# Altium schematic sheet tie-il-cfg.SchDoc: Copper Suicide - Net Tie CFG
size Letter; CheckedBy: E. Chiu; CompanyName: Signal Laboratories, Inc.; DrawnBy: J. Brinton; Engineer: J. Brinton; Address1: 3479 Edison Way; Address2: Menlo Park CA 94025; Address3: +1 (877) 778-8435; Address4: siglabs.com; Revision: 1; SheetNumber: 20; SheetTotal: 44
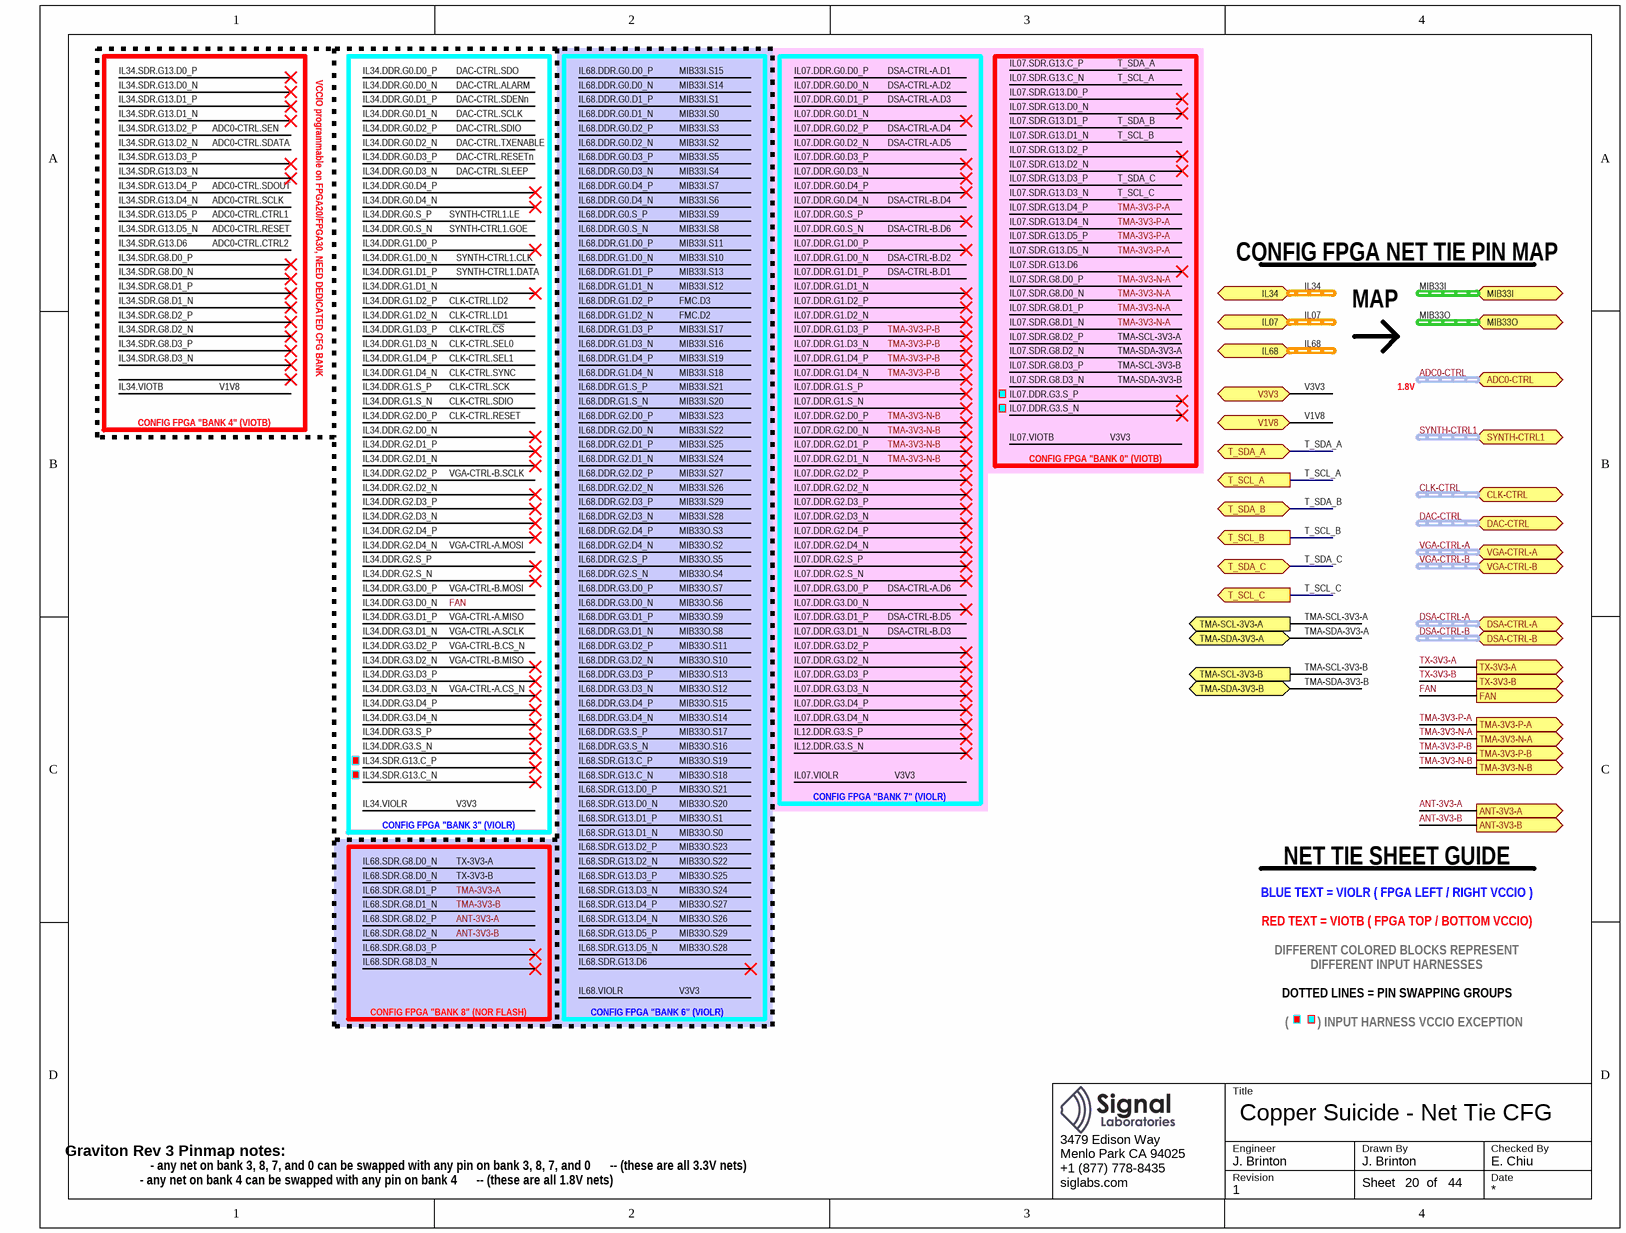
[diagram p0: tie-il-cfg.SchDoc]

## Ports
ADC0-CTRL (harness ADC-CTRL-1V8), ANT-3V3-A (out), ANT-3V3-B (out), CLK-CTRL (harness CLK-CTRL), DAC-CTRL (harness DAC-CTRL), DSA-CTRL-A (harness DSA_CTRL), DSA-CTRL-B (harness DSA_CTRL), FAN (out), IL07 (harness IL), IL34 (harness IL), IL68 (harness IL), MIB33I (harness MIB), MIB33O (harness MIB), SYNTH-CTRL1 (harness SYNTH-CTRL), T_SCL_A (out), T_SCL_B (out), T_SCL_C (out), T_SDA_A (bidir), T_SDA_B (bidir), T_SDA_C (bidir), TMA-3V3-N-A (out), TMA-3V3-N-B (out), TMA-3V3-P-A (out), TMA-3V3-P-B (out), TMA-SCL-3V3-A (out), TMA-SCL-3V3-B (out), TMA-SDA-3V3-A (bidir), TMA-SDA-3V3-B (bidir), TX-3V3-A (out), TX-3V3-B (out), V1V8, V3V3, VGA-CTRL-A (harness SPI), VGA-CTRL-B (harness SPI)

## Nets
ANT-3V3-A: port ANT-3V3-A  [also labelled IL68.SDR.G8.D2_P]
ANT-3V3-B: port ANT-3V3-B  [also labelled IL68.SDR.G8.D2_N]
FAN: port FAN  [also labelled IL34.DDR.G3.D0_N]
IL07.DDR.G1.D3_N: port TMA-3V3-P-B  [also labelled IL07.DDR.G1.D3_P, IL07.DDR.G1.D4_N, IL07.DDR.G1.D4_P, TMA-3V3-P-B]
IL07.DDR.G2.D0_N: port TMA-3V3-N-B  [also labelled IL07.DDR.G2.D0_P, IL07.DDR.G2.D1_N, IL07.DDR.G2.D1_P, TMA-3V3-N-B]
IL07.SDR.G8.D0_N: port TMA-3V3-N-A  [also labelled IL07.SDR.G8.D0_P, IL07.SDR.G8.D1_N, IL07.SDR.G8.D1_P, TMA-3V3-N-A]
IL07.SDR.G8.D2_N: port TMA-SDA-3V3-A  [also labelled TMA-SDA-3V3-A]
IL07.SDR.G8.D2_P: port TMA-SCL-3V3-A  [also labelled TMA-SCL-3V3-A]
IL07.SDR.G8.D3_N: port TMA-SDA-3V3-B  [also labelled TMA-SDA-3V3-B]
IL07.SDR.G8.D3_P: port TMA-SCL-3V3-B  [also labelled TMA-SCL-3V3-B]
IL07.SDR.G13.C_N: port T_SCL_A  [also labelled T_SCL_A]
IL07.SDR.G13.C_P: port T_SDA_A  [also labelled T_SDA_A]
IL07.SDR.G13.D1_N: port T_SCL_B  [also labelled T_SCL_B]
IL07.SDR.G13.D1_P: port T_SDA_B  [also labelled T_SDA_B]
IL07.SDR.G13.D3_N: port T_SCL_C  [also labelled T_SCL_C]
IL07.SDR.G13.D3_P: port T_SDA_C  [also labelled T_SDA_C]
IL07.SDR.G13.D4_N: port TMA-3V3-P-A  [also labelled IL07.SDR.G13.D4_P, IL07.SDR.G13.D5_N, IL07.SDR.G13.D5_P, TMA-3V3-P-A]
IL07.VIOLR: port V3V3  [also labelled IL07.VIOTB, IL34.VIOLR, IL68.VIOLR, V3V3]
IL34.VIOTB: port V1V8  [also labelled V1V8]
IL68.SDR.G8.D0_N: port TX-3V3-B, port TX-3V3-A  [also labelled TX-3V3-A, TX-3V3-B]

## Buses and harness runs
harness ADC0-CTRL = port ADC0-CTRL
harness CLK-CTRL = port CLK-CTRL
harness DAC-CTRL = port DAC-CTRL
harness DSA-CTRL-A = port DSA-CTRL-A
harness DSA-CTRL-B = port DSA-CTRL-B
harness IL07 = port IL07
harness IL34 = port IL34
harness IL68 = port IL68
harness MIB33I = port MIB33I
harness MIB33O = port MIB33O
harness SYNTH-CTRL1 = port SYNTH-CTRL1
harness VGA-CTRL-A = port VGA-CTRL-A
harness VGA-CTRL-B = port VGA-CTRL-B

## Notes on the sheet
- VCCIO programmable on FPGA20/FPGA30, NEED DEDICATED CFG BANK
- CONFIG FPGA NET TIE PIN MAP
- MAP
- 1.8V
- CONFIG FPGA "BANK 4" (VIOTB)
- CONFIG FPGA "BANK 0" (VIOTB)
- CONFIG FPGA "BANK 3" (VIOLR)
- CONFIG FPGA "BANK 7" (VIOLR)
- BLUE TEXT = VIOLR ( FPGA LEFT / RIGHT VCCIO )
- NET TIE SHEET GUIDE
- DIFFERENT INPUT HARNESSES
- DIFFERENT COLORED BLOCKS REPRESENT
- RED TEXT = VIOTB ( FPGA TOP / BOTTOM VCCIO)
- CONFIG FPGA "BANK 8" (NOR FLASH)
- CONFIG FPGA "BANK 6" (VIOLR)
- DOTTED LINES = PIN SWAPPING GROUPS
- (         ) INPUT HARNESS VCCIO EXCEPTION
- Graviton Rev 3 Pinmap notes:
- - any net on bank 4 can be swapped with any pin on bank 4      -- (these are all 1.8V nets)
- - any net on bank 3, 8, 7, and 0 can be swapped with any pin on bank 3, 8, 7, and 0      -- (these are all 3.3V nets)
- Title
- Engineer
- Revision
- Drawn By
- Checked By
- Date
- Sheet
- of